# Altium project Motor Driver_r1.1.PrjPCB
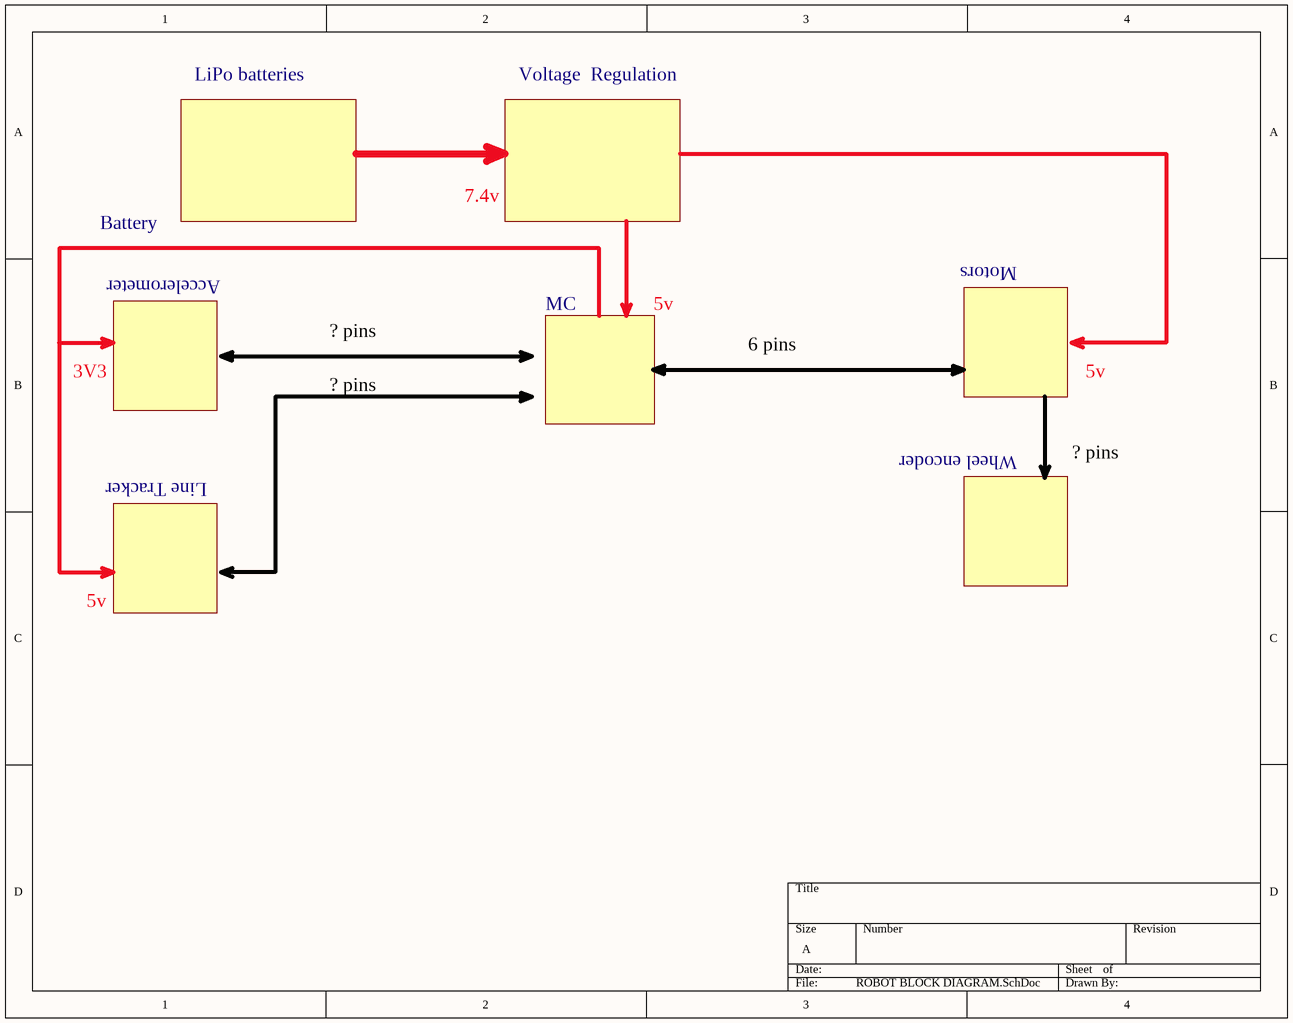
[diagram p0: ROBOT BLOCK DIAGRAM.SchDoc]
2 sheets, 25 parts. Net scope: global (net labels, ports and power ports of the same name join across sheets).
Board file: Motor_Driver_r1.1.PcbDoc
Sheets:
  ROBOT BLOCK DIAGRAM.SchDoc
  Motor_Driver_r1.1.SchDoc

## Sheet ROBOT BLOCK DIAGRAM.SchDoc
size A

### Notes on the sheet
- LiPo batteries
- Voltage  Regulation
- Battery
- 7.4v
- Accelerometer
- Motors
- ? pins
- MC
- 5v
- 6 pins
- 3V3
- Line Tracker
- Wheel encoder

## Sheet Motor_Driver_r1.1.SchDoc
size A4; DrawnBy: Mat McCann; Organization: Robotics Club; Address1: 3800 Finnerty Rd; Address2: University of Victoria; Address3: Victoria, BC, Canada; Revision: 1.1; SheetNumber: 1; SheetTotal: 1
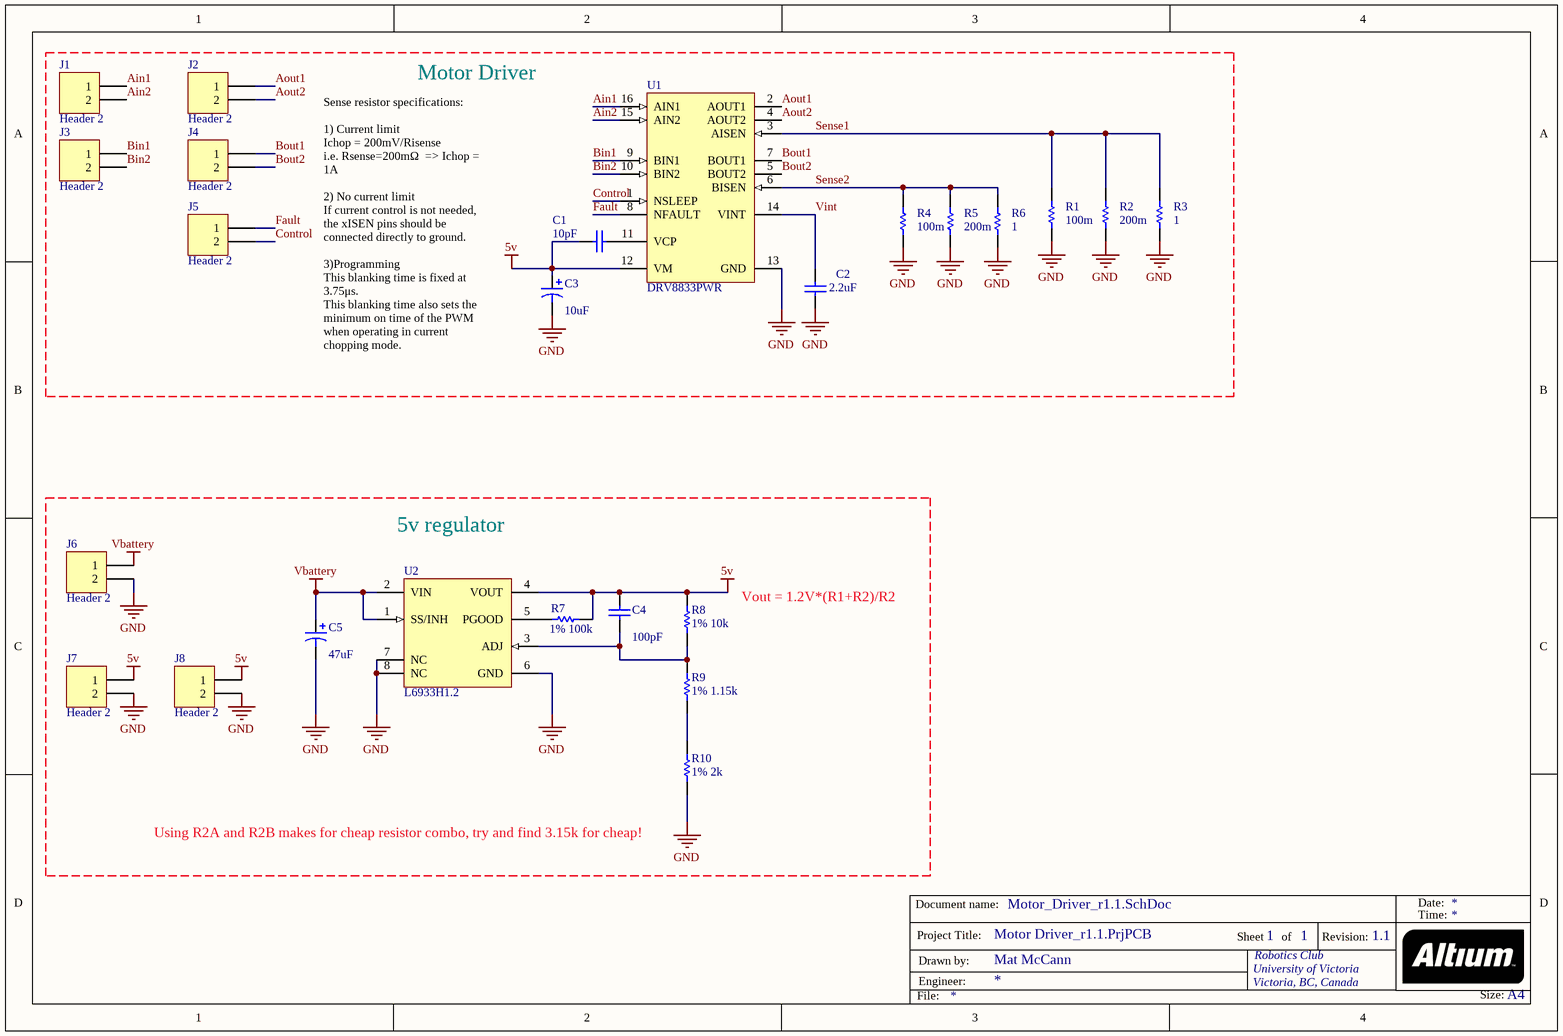
[diagram p1: Motor_Driver_r1.1.SchDoc]

### Parts
C1  value 10pF  [6-0805_M]  (hidden comment: 10pF cap)
C2  value 2.2uF  [6-0805_M]  (hidden comment: 2.2uF cap)
C3  value 10uF  [CAP SMD]
C4  value 100pF  [6-0805_M]  (hidden comment: 100pF Cap)
C5  value 47uF  [capacitor_tantalum]  (hidden comment: 47uF Electrolytic)
J1  Header 2  [HDR1X2]
J2  Header 2  [HDR1X2]
J3  Header 2  [HDR1X2]
J4  Header 2  [HDR1X2]
J5  Header 2  [HDR1X2]
J6  Header 2  [HDR1X2]
J7  Header 2  [HDR1X2]
J8  Header 2  [HDR1X2]
R1  100m  [6-0805_M]
R2  200m  [6-0805_M]
R3  1  [6-0805_M]
R4  100m  [6-0805_M]
R5  200m  [6-0805_M]
R6  1  [6-0805_M]
R7  1% 100k  [6-0805_M]
R8  1% 10k  [6-0805_M]
R9  1% 1.15k  [6-0805_M]
R10  1% 2k  [6-0805_M]
U1  DRV8833PWR  [TI-PW16_M]
U2  L6933H1.2  [SO8_M]

### Blocks framed on the sheet
Motor Driver: C1-C3 J1-J5 R1-R6 U1
5v regulator: C4 C5 J6-J8 R7-R10 U2

### Nets
5v: C1.2 C3.1 C4.2 J7.1 J8.1 R7.2 R8.2 U1.12(VM) U2.4(VOUT)
GND: C2.1 C3.2 C5.2 J6.2 J7.2 J8.2 R1.1 R2.1 R3.1 R4.1 R5.1 R6.1 R10.1 U1.13(GND) U2.6(GND) U2.7(NC) U2.8(NC)
Vbattery: C5.1 J6.1 U2.1(SS/INH) U2.2(VIN)
Ain1: J1.1 U1.16(AIN1)
Ain2: J1.2 U1.15(AIN2)
Aout1: J2.1 U1.2(AOUT1)
Aout2: J2.2 U1.4(AOUT2)
Bin1: J3.1 U1.9(BIN1)
Bin2: J3.2 U1.10(BIN2)
Bout1: J4.1 U1.7(BOUT1)
Bout2: J4.2 U1.5(BOUT2)
Control: J5.2 U1.1(NSLEEP)
Fault: J5.1 U1.8(NFAULT)
Sense1: R1.2 R2.2 R3.2 U1.3(AISEN)
Sense2: R4.2 R5.2 R6.2 U1.6(BISEN)
Vint: C2.2 U1.14(VINT)
NetC1_1: C1.1 U1.11(VCP)
NetC4_1: C4.1 R8.1 R9.2 U2.3(ADJ)
NetR7_1: R7.1 U2.5(PGOOD)
NetR9_1: R9.1 R10.2

### Notes on the sheet
- Sense resistor specifications:
  1) Current limit
  Ichop = 200mV/Risense
  i.e. Rsense=200mΩ  => Ichop = 1A
  2) No current limit
  If current control is not needed, the xISEN pins should be connected directly to ground.
  3)Programming
  This blanking time is fixed at 3.75μs.
  This blanking time also sets the minimum on time of the PWM when operating in current chopping mode.
- Vout = 1.2V*(R1+R2)/R2
- (near R10) Using R2A and R2B makes for cheap resistor combo, try and find 3.15k for cheap!
- Document name:
- Date:
- Time:
- Project Title:
- Drawn by:
- Engineer:
- Sheet
- of
- Revision:
- File:
- Size:
- A4

### Library data of the parts
C1 = cap: Capacitor; Manufacturer Part Number 1: C0805C100M4GACTU; Manufacturer 1: Kemet; Published: 8-Jun-2000; LatestRevisionDate: 17-Jul-2002; PackageReference: RAD-0.3; PackageDescription: Radial Cap, Thru-Hole; 2 Leads; 0.3 in Pin Spacing; Supplier 1: Digikey; Supplier Part Number 1: 399-9147-1-ND; Link: https://www.digikey.ca/product-search/en?keywords=399-9147-1-ND; Supplier Unit Price 1: 0.14
C2 = cap: Capacitor; Manufacturer Part Number 1: GRM21BR71C225KA12L; Manufacturer 1: Murata; Published: 8-Jun-2000; LatestRevisionDate: 17-Jul-2002; PackageReference: RAD-0.3; PackageDescription: Radial Cap, Thru-Hole; 2 Leads; 0.3 in Pin Spacing; Supplier Part Number 1: 490-3906-1-ND; Supplier 1: Digikey; Link: https://www.digikey.ca/product-search/en?keywords=490-3906-1-ND; Supplier Unit Price 1: 0.29
C3 = Cap Pol1: Polarized Capacitor (Radial); Manufacturer Part Number 1: UWX1C100MCL2GB; Manufacturer 1: Nichicon; Published: 8-Jun-2000; LatestRevisionDate: 17-Jul-2002; PackageReference: RB7.6-15; PackageDescription: Polarized Capacitor (Radial); 2 Leads; Supplier Part Number 1: 493-2099-1-ND; Supplier 1: Digikey; Link: https://www.digikey.ca/product-search/en?keywords=493-2099-1-ND; Supplier Unit Price 1: 0.39
C4 = Cap: Capacitor; Manufacturer Part Number 1: 885012007016; Manufacturer 1: Wurth Electronics Inc; Published: 8-Jun-2000; LatestRevisionDate: 17-Jul-2002; PackageReference: RAD-0.3; PackageDescription: Radial Cap, Thru-Hole; 2 Leads; 0.3 in Pin Spacing; Supplier Part Number 1: 732-7820-1-ND; Supplier 1: digikey; Link: https://www.digikey.ca/product-search/en?keywords=732-7820-1-ND; Supplier Unit Price 1: 0.14
C5 = Cap Pol1: Polarized Capacitor (Radial); manufacture: UPJ1C470MDD1TD; Manufacturer 1: Nichicon; Published: 8-Jun-2000; LatestRevisionDate: 17-Jul-2002; PackageReference: RB7.6-15; PackageDescription: Polarized Capacitor (Radial); 2 Leads; Supplier Part Number 1: 493-11373-1-ND; Supplier 1: Digikey; Link: https://www.digikey.ca/product-search/en?keywords=493-11373-1-ND; Manufacturer Part Number 1: UPJ1C470MDD1TD; Supplier Unit Price 1: 0.35
J1-J8 = Header 2: Header, 2-Pin; Manufacturer Part Number 1: 640456-2; Manufacturer 1: TE Connectivity AMP Connectors; LatestRevisionDate: 17-Jul-2002; Supplier Part Number 1: A1921-ND; Supplier 1: Digikey; Link: https://www.digikey.ca/product-search/en?keywords=A1921-ND; Supplier Unit Price 1: 0.17
R1 R4 = Res1: Resistor; Manufacturer Part Number 1: 73L3R10J; Manufacturer 1: CTS Resistor Products; Published: 8-Jun-2000; LatestRevisionDate: 17-Jul-2002; PackageReference: AXIAL-0.3; PackageDescription: Axial Device, Thru-Hole; 2 Leads; 0.3 in Pin Spacing; Value: 100m; Supplier 1: Digikey; Link: https://www.digikey.ca/product-search/en?keywords=73L3R10JCT-ND; Supplier Unit Price 1: 0.15
  R1: Supplier Part Number 1: 73L3R10JCT-ND
  R4: Supplier Part Number 1: 73L3R20JCT-ND
R2 R5 = Res1: Resistor; Manufacturer Part Number 1: 73L3R20J; Manufacturer 1: CTS Resistor Products; Published: 8-Jun-2000; LatestRevisionDate: 17-Jul-2002; PackageReference: AXIAL-0.3; PackageDescription: Axial Device, Thru-Hole; 2 Leads; 0.3 in Pin Spacing; Value: 200m; Supplier Part Number 1: 73L3R20JCT-ND; Supplier 1: Digikey; Link: https://www.digikey.ca/product-search/en?keywords=73L3R20JCT-ND; Supplier Unit Price 1: 0.15
R3 R6 = Res1: Resistor; Manufacturer Part Number 1: RC0603FR-071RL; Manufacturer 1: CTS Resistor Products; Published: 8-Jun-2000; LatestRevisionDate: 17-Jul-2002; PackageReference: AXIAL-0.3; PackageDescription: Axial Device, Thru-Hole; 2 Leads; 0.3 in Pin Spacing; Value: 1; Supplier 1: Digikey; Link: https://www.digikey.ca/product-search/en?keywords=311-1.00HRCT-ND; Supplier Unit Price 1: 0.15
  R3: Supplier Part Number 1: 311-1.00HRCT-ND
  R6: Supplier Part Number 1: 73L3R20JCT-ND
R7 = Res1: Resistor; manufacture: RC0805FR-07100KL; Manufacturer 1: Yageo; Published: 8-Jun-2000; LatestRevisionDate: 17-Jul-2002; PackageReference: AXIAL-0.3; PackageDescription: Axial Device, Thru-Hole; 2 Leads; 0.3 in Pin Spacing; Value: 100k; Supplier Part Number 1: 311-100KCRCT-ND; Supplier 1: digikey; Link: https://www.digikey.ca/product-search/en?keywords=311-100KCRCT-ND; Manufacturer Part Number 1: RC0805FR-07100KL; Supplier Unit Price 1: 0.15
R8 = Res1: Resistor; Manufacturer Part Number 1: RC0805FR-0710KL; Manufacturer 1: Yageo; Published: 8-Jun-2000; LatestRevisionDate: 17-Jul-2002; PackageReference: AXIAL-0.3; PackageDescription: Axial Device, Thru-Hole; 2 Leads; 0.3 in Pin Spacing; Value: 10k; Supplier Part Number 1: 311-10.0KCRCT-ND; Supplier 1: digikey; Link: https://www.digikey.ca/product-search/en?keywords=311-10.0KCRCT-ND; Supplier Unit Price 1: 0.15
R9 R10 = Res1: Resistor; Manufacturer Part Number 1: RC0805FR-071K15L; Manufacturer 1: Yageo; Published: 8-Jun-2000; LatestRevisionDate: 17-Jul-2002; PackageReference: AXIAL-0.3; PackageDescription: Axial Device, Thru-Hole; 2 Leads; 0.3 in Pin Spacing; Supplier Part Number 1: 311-1.15KCRCT-ND; Supplier 1: Digikey; Link: https://www.digikey.ca/product-search/en?keywords=311-1.15KCRCT-ND; Supplier Unit Price 1: 0.15
  R9: Value: 1.15k
  R10: Value: 2k
U1 = CMP-1529-00001-1: 2 A Low Voltage Dual Brushed DC or Single Bipolar Stepper Motor Driver (PWM Ctrl), 2.7 to 10.8 V, -40 to 85 degC, 16-Pin SOP (PW), Green (RoHS & no Sb/Br), Tape and Reel; Manufacturer 1: Texas Instruments; ComponentLink1URL: www.ti.com; PackageDescription: 16-Pin Plastic Small Outline, Body 4.4 x 5 mm, Pitch 0.65 mm; Packing: Tape and Reel; Supplier 1: Digikey; Supplier Part Number 1: 296-40080-1-ND; Link: https://www.digikey.ca/product-search/en?keywords=296-40080-1-ND; Manufacturer Part Number 1: DRV8833PWR; Supplier Unit Price 1: 3.65
U2 = CMP-0240-00057-1: High Performance 2A ULDO Linear Regulator with Soft Start, 8-Pin SO; Manufacturer Part Number 1: L6932H1.2TR; Manufacturer 1: STMicroelectronics; PackageReference: SO8; PackageDescription: 8-Pin Small Outline Integrated Circuit 1.27 mm Pitch; ComponentLink1URL: http://www.st.com; Supplier Part Number 1: 497-7766-1-ND; Supplier 1: Digikey; Link: https://www.digikey.ca/product-search/en?keywords=497-7766-1-ND; Supplier Unit Price 1: 3.94